# EAGLE design E200 (EAGLE 9.5.1)
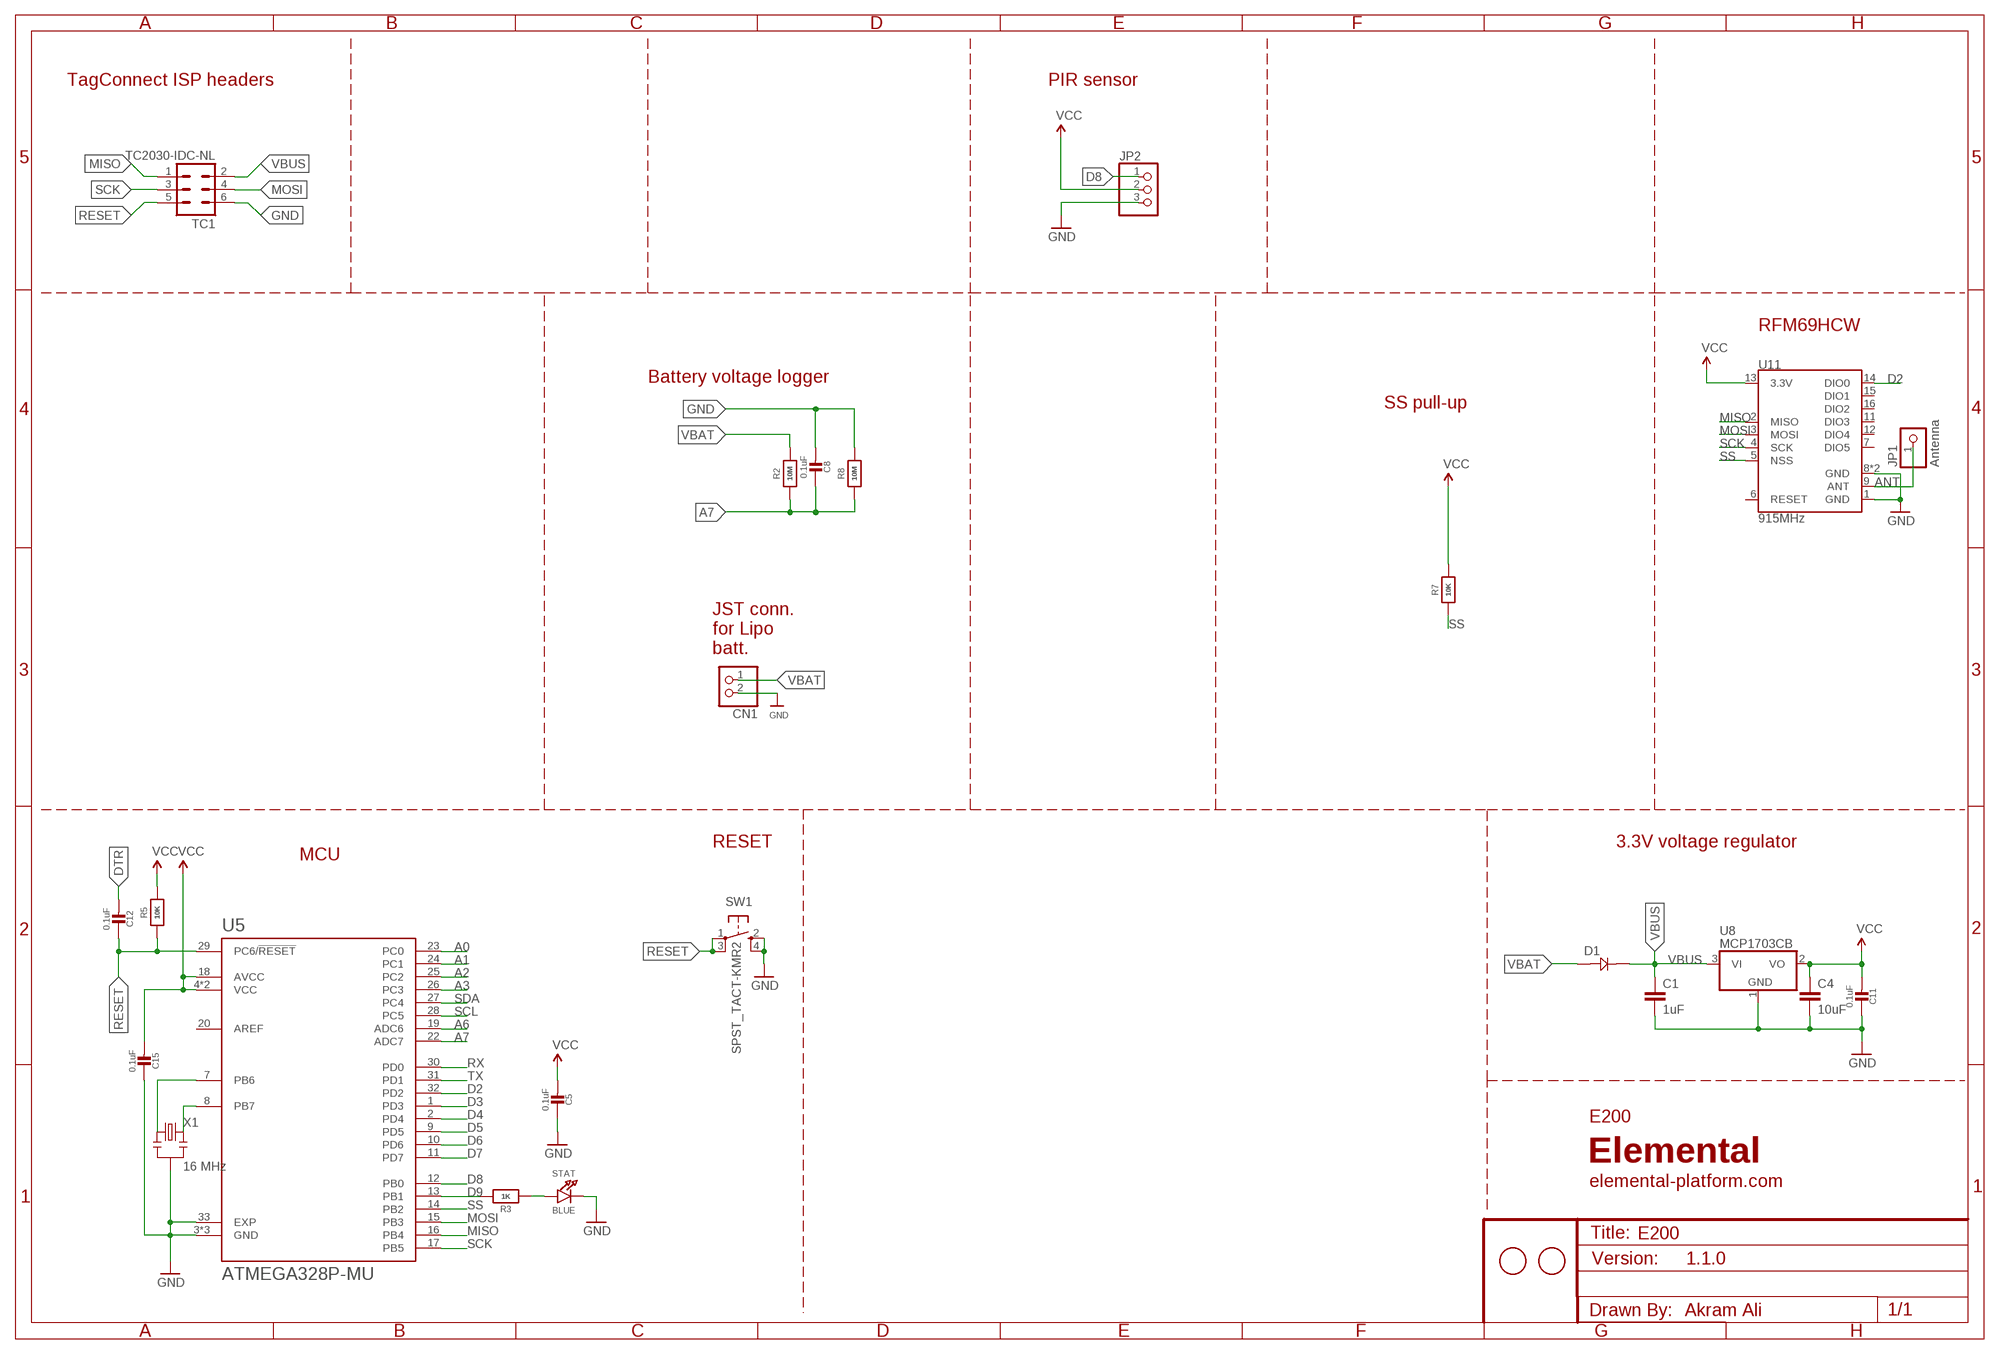
[diagram p0: schematic, sheet 1]

## Parts
C1  1uF  CAP0805  [0805]
C4  10uF  CAP0805  [0805]
C5  0.1uF  MICROBUILDER_CAP_CERAMIC_0402MP  [MICROBUILDER__0402MP]
C8  0.1uF  MICROBUILDER_CAP_CERAMIC_0402MP  [MICROBUILDER__0402MP]
C11  0.1uF  MICROBUILDER_CAP_CERAMIC_0402MP  [MICROBUILDER__0402MP]
C12  0.1uF  MICROBUILDER_CAP_CERAMIC_0402MP  [MICROBUILDER__0402MP]
C15  0.1uF  MICROBUILDER_CAP_CERAMIC_0402MP  [MICROBUILDER__0402MP]
CN1  JST_2PIN-SMT-RA  [JST-PH-2-SMT-RA]
D1  DIODE_SCHOTTKY0805-RES  [0805]
JP1  Antenna  PINHD-1X1CB  [1X01-CLEANBIG]
JP2  PINHD-1X3  [1X03]
R2  10M  MICROBUILDER_RESISTOR_0402MP  [MICROBUILDER__0402MP]
R3  1K  MICROBUILDER_RESISTOR_0402MP  [MICROBUILDER__0402MP]
R5  10K  MICROBUILDER_RESISTOR_0402MP  [MICROBUILDER__0402MP]
R7  10K  MICROBUILDER_RESISTOR_0402MP  [MICROBUILDER__0402MP]
R8  10M  MICROBUILDER_RESISTOR_0402MP  [MICROBUILDER__0402MP]
STAT  BLUE  LED0805_NOOUTLINE  [CHIPLED_0805_NOOUTLINE]
SW1  SPST_TACT-KMR2  [KMR2]
TC1  TC2030-IDC-NL  [TC2030-IDC-NL]
U5  ATMEGA328P-MU  [QFN50P500X500X100-33N]
U8  MCP1703CB  [SOT23]
U11  915MHz  RFM69HCW-915  [RFM69HCW-XXXS2]
U$1  FIDUCIAL  [FIDUCIAL_1MM]
U$7  FIDUCIAL  [FIDUCIAL_1MM]
X1  16 MHz  RESONATORSMD  [RESONATOR-SMD]

## Nets
A0: U5.23(PC0)
A1: U5.24(PC1)
A2: U5.25(PC2)
A3: U5.26(PC3)
A6: U5.19(ADC6)
A7: C8.1 R2.1 R8.1 U5.22(ADC7)
ANT: JP1.1 U11.9(ANT)
D2: U5.32(PD2) U11.14(DIO0)
D3: U5.1(PD3)
D4: U5.2(PD4)
D5: U5.9(PD5)
D6: U5.10(PD6)
D7: U5.11(PD7)
D8: JP2.1 U5.12(PB0)
D9: R3.2 U5.13(PB1)
DTR: C12.2
GND: C1.2 C4.2 C5.1 C8.2 C11.1 C15.1 CN1.2 JP2.3 R8.2 STAT.C SW1.2(S) SW1.4(S1) TC1.6 U5.3(GND) U5.5(GND) U5.21(GND) U5.33(EXP) U8.1(GND) U11.1(GND) U11.8(GND) U11.10(GND) X1.2
MISO: TC1.1 U5.16(PB4) U11.2(MISO)
MOSI: TC1.4 U5.15(PB3) U11.3(MOSI)
N$4: U5.8(PB7) X1.3
N$5: U5.7(PB6) X1.1
N$8: R3.1 STAT.A
RESET: C12.1 R5.1 SW1.1(P) SW1.3(P1) TC1.5 U5.29(PC6/!RESET)
RX: U5.30(PD0)
SCK: TC1.3 U5.17(PB5) U11.4(SCK)
SCL: U5.28(PC5)
SDA: U5.27(PC4)
SS: R7.1 U5.14(PB2) U11.5(NSS)
TX: U5.31(PD1)
VBAT: CN1.1 D1.1 R2.2
VBUS: C1.1 D1.2 TC1.2 U8.3(VI)
VCC: C4.1 C5.2 C11.2 C15.2 JP2.2 R5.2 R7.2 U5.4(VCC) U5.6(VCC) U5.18(AVCC) U8.2(VO) U11.13(3.3V)
Unconnected: U5.20(AREF) U11.6(RESET) U11.7(DIO5) U11.11(DIO3) U11.12(DIO4) U11.15(DIO1) U11.16(DIO2)

## Notes on the sheet
- TagConnect ISP headers | PIR sensor
- RFM69HCW
- Battery voltage logger
- SS pull-up
- JST conn.
  for Lipo
  batt.
- RESET | 3.3V voltage regulator
- MCU
- E200
- Elemental
- elemental-platform.com
- 1.1.0
- Akram Ali

## Library data of the parts
C1 = SparkFun-Capacitors:CAP: Capacitor Standard 0603 ceramic capacitor, and 0.1" leaded capacitor.; MPN: CC0805ZRY5V8BB105
C4 = SparkFun-Capacitors:CAP: Capacitor Standard 0603 ceramic capacitor, and 0.1" leaded capacitor.; MPN: CC0805KKX5R6BB106
C5 C8 C11 C12 C15 = Adafruit Feather 32u4 Bluefruit LE:MICROBUILDER_CAP_CERAMIC: Ceramic Capacitors For new designs, use the packages preceded by an '_' character since they are more reliable: The following footprints should be used on most boards: _0402 - Standard footprint for regular board layouts _0603 - Standard footprint for regular board layouts _0805 - Standard footprint for regular board layouts _1206 - Standard footprint for regular board layouts For extremely tight-pitch boards where space is at a premium, the following 'micro-pitch' footprints can be used (smaller pads, no silkscreen outline, etc.): _0402MP - Micro-pitch footprint for very dense/compact boards _0603MP - Micro-pitch footprint for very dense/compact boards _0805MP - Micro-pitch footprint for very dense/compact boards _1206MP - Micro-pitch footprint for very dense/compact boards; MPN: GRM155R71C104KA88J
CN1 = adafruit:JST_2PIN: JST 2-Pin Connectors of various flavors SMT-RA (S2B-PH-SM4) 4UConnector #17311 SMT (B2B-PH-SM4) THM-RA (S2B-PH) THM (B2B-PH)
D1 = SCHOTTKY_0805:DIODE_SCHOTTKY
JP1 = adafruit@1:PINHD-1X1: Pin header 1x1 for 0.1" spacing With round pins; MPN: Helical antenna
JP2 = adafruit:PINHD-1X3: PIN HEADER
R2 R3 R5 R7 R8 = Adafruit Feather 32u4 Bluefruit LE:MICROBUILDER_RESISTOR: Resistors For new designs, use the packages preceded by an '_' character since they are more reliable: The following footprints should be used on most boards: _0402 - Standard footprint for regular board layouts _0603 - Standard footprint for regular board layouts _0805 - Standard footprint for regular board layouts _1206 - Standard footprint for regular board layouts For extremely tight-pitch boards where space is at a premium, the following 'micro-pitch' footprints can be used (smaller pads, no silkscreen outline, etc.): _0402MP - Micro-pitch footprint for very dense/compact boards _0603MP - Micro-pitch footprint for very dense/compact boards _0805MP - Micro-pitch footprint for very dense/compact boards _1206MP - Micro-pitch footprint for very dense/compact boards; MPN: RC0402JR-0710KL
STAT = microbuilder:LED: LED 0603 - 0603 Surface Mount Package 2mA: Green LED - Low Power (3.9mcd, 2ma, 1.7Vf) - Digikey: 475-2709-2-ND Orange LED - Low Power (9.8mcd, 2ma, 1.8Vf) - Digikey: 475-1194-2-ND Red LED - Low Power (5mcd, 2ma, 1.8Vf) - Digikey: 475-1195-2-ND Yellow LED - Low Power (7mcd, 2ma, 1.8Vf) - Digikey: 475-1196-2-ND 5mA: Blue LED - Low Power (17mcd, 5ma, 2.9Vf) - Digikey: LNJ937W8CRACT-ND 0805 - 0805 Surface Mount Package 2mA: Red LED (8.8mcd, 2mA, 1.8Vf, Clear) - Low Power [Digikey: 475-2510-1-ND] Green LED (5mcd, 2mA, 1.8Vf, Clear) - Low Power [Digikey: 475-2730-1-ND] Yellow LED (11.3mcd, 2mA, 1.8Vf, Clear) - Low Power [Digikey: 475-2555-1-ND] 20mA: Red LED (104mcd, 20mA, Diffused) - LS R976 [Digikey: 475-1278-6-ND] Red LED (12mcd, 20mA, 2.0Vf, Clear) - APT2012EC [Digikey: 754-1128-1-ND] Green LED (15mcd, 20mA, 2.2Vf, Clear) - APT2012GC [Digikey: 754-1131-1-ND] Orange LED (160mcd, 20mA, 2.1Vf, Clear) - APT2012SECK [Digikey: 754-1130-1-ND] 1206 - 1206 Surface Mount Package Green LED (26mcd, 20mA, Diffused) - LG N971 [Digikey: 475-1407-6-ND] Red LED (15mcd, 20mA, Diffused) - LH N974 [Digikey: 475-1416-6-ND] Cree - Cree High-Power Surface Mount LEDs XPEBWT-L1-0000-00D50 - White 111lm 350mA 2.9Vf 6200K 110° XTEAWT-00-0000-00000LEE3 - White 114lm 350mA 2.85Vf 5000K 115° Everlight - Everlight 45-21 Series Surface Mount LEDs 45-21/QK2C-B2832AC2CB2/2T - Warm White 2000mcd 20mA 3.25Vf 3050K 120° 45-21/LK2C-B38452C4CB2/2T - Nuetral White 2000mcd 20mA 3.25Vf 4150K 120° 45-21/LK2C-B50634C6CB2/2T - Cold White 2200mcd 20mA 3.25Vf 5650K 120° PLCC2 Reverse Mount LS T77K-J1L2-1-0-2-R18-Z - Red 11.25mcd 2mA 1.8Vf 630nm 120° LO T77K-L1M2-24-Z - Orange 19.6mcd 2mA 1.8Vf 606nm 120° LY T77K-K2M1-26-Z - Yellow 15.7mcd 2mA 1.8Vf 587nm 120°
SW1 = adafruit:SPST_TACT: SMT 6mm switch, EVQQ2 series http://www.ladyada.net/library/eagle
TC1 = TagConnect:TC2030-IDC: Tag-Connect In Circuit Programming & Debug Cable 6 Pin http://www.tag-connect.com
U5 = ATMEGA328P-MU:ATMEGA328P-MU: ATmega Series 20 MHz 32 KB Flash 2 KB SRAM 8-Bit Microcontroller - QFN-32; AVAILABILITY: Good; DESCRIPTION: ATmega Series 20 MHz 32 KB Flash 2 KB SRAM 8-Bit Microcontroller - QFN-32; MF: Atmel; MP: ATMEGA328P-MU; MPN: ATMEGA328P-MU; PACKAGE: QFN-32 Atmel; PRICE: 2.55 USD
U8 = linear:MCP1703: 250 mA, 16V, Low Quiescent Current LDO Regulator Source: http://ww1.microchip.com/downloads/en/DeviceDoc/22049b.pdf; MPN: MCP1703T-3302E/CB; OC_NEWARK: 18T9177
U11 = SparkFun-RF:RFM69H: Hope RF RFM69H ISM Transceiver Module The RFM69H is a transceiver module capable of operation over a wide frequency range, including the 315,433,868 and 915MHz license-free ISM (Industry Scientific and Medical) frequency bands. All major RF communication parameters are programmable and most of them can be dynamically set. The RFM69H offers the unique advantage of programmable narrow-band and wide- band communication modes. The RFM69H is optimized for low power consumption while offering high RF output power and channelized operation.Compliance ETSI and FCC regulations. Datasheet <http://www.hoperf.cn/upload/docs/RF/SX/RFM69H_DataSheet_v1.3.pdf> SparkFun Products RFM69HCW Wireless Transceiver - 915MHz <https://www.sparkfun.com/products/13909> (COM-13909) RFM69HCW Wireless Transceiver - 434MHz <https://www.sparkfun.com/products/13910> (COM-13910) SparkFun RFM69 Breakout (915MHz) <https://www.sparkfun.com/products/12775> (WRL-12775) SparkFun RFM69 Breakout (434MHz) <https://www.sparkfun.com/products/12823> (WRL-12823); MPN: RFM69HCW; PROD_ID: IC-11997
U$1 U$7 = adafruit:FIDUCIAL: For use by pick and place machines to calibrate the vision/machine, 1mm By microbuilder.eu
X1 = SparkFun:RESONATOR: Resonator Small SMD resonator. This is the itty bitty 10/20MHz resonators with built in caps. CSTCE10M0G55 and CSTCE20M0V53. Footprint has been reviewed closely but hasn't been tested yet.; MPN: CSTCE16M0V53-R0

## Net classes
1 power: width 0.381 mm, clearance 0.254 mm

## Board
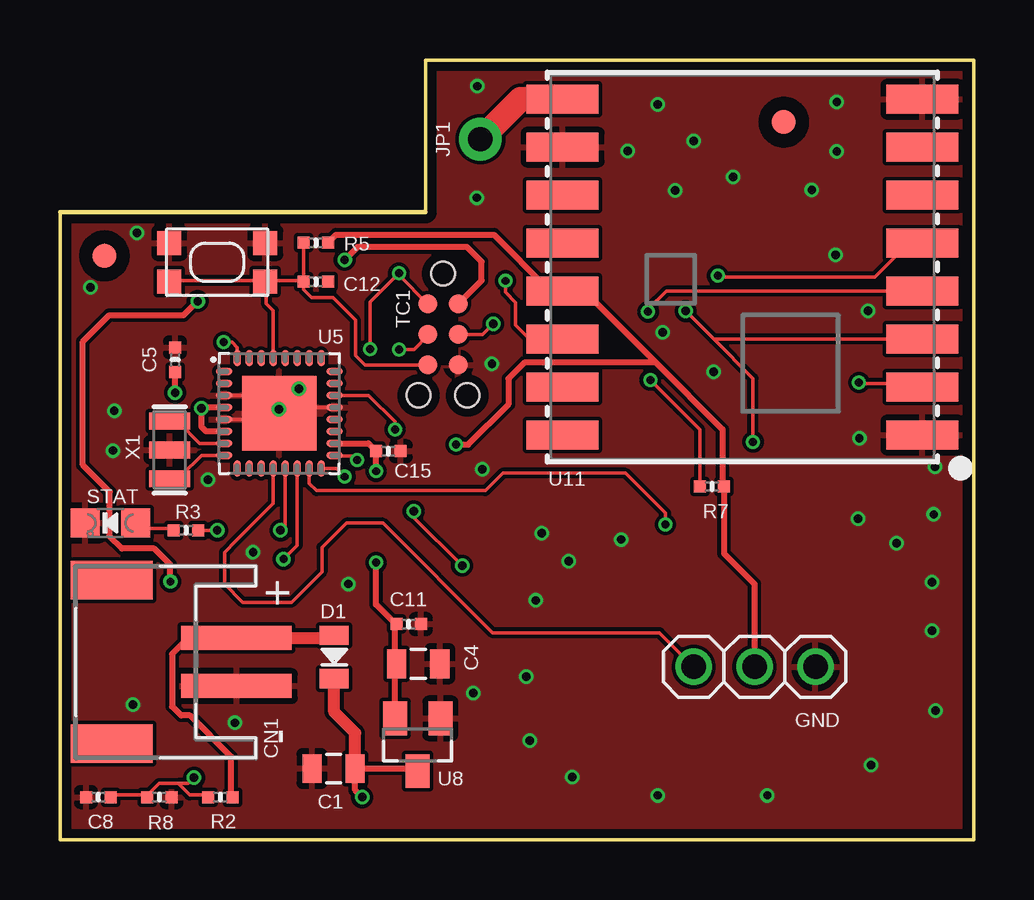
[diagram p1: board, top side]
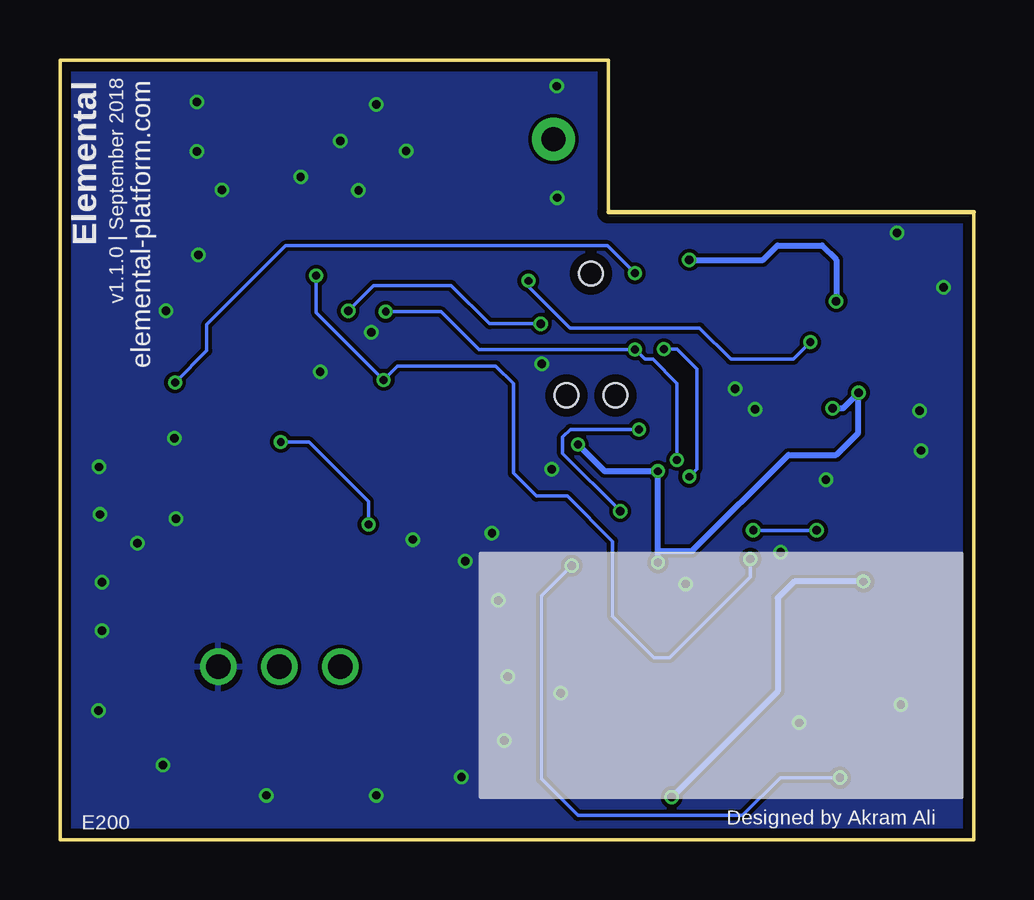
[diagram p2: board, bottom side, seen from below]

Size 38.1 x 32.51 mm. Coordinates in mm from the lower left corner, seen from the top.
Outline: 0,26.16 15.24,26.16 15.24,32.51 38.1,32.51 38.1,0 0,0 0,26.16
Copper layers (1*16): Top 0.035559375mm / dielectric 1.6mm / Bottom 0.035559375mm
Design rules "oshpark-2layer *": minimum track width 6mil, minimum drill 10mil, track to track 6mil, track to pad 6mil, pad to pad 6mil, via to via 6mil, smd to smd 6mil, copper to edge 15mil, drill to drill 6mil, minimum pad ring 5mil, minimum via ring 5mil, stop-mask expansion 2.5mil, vias tented up to drill 14mil, thermal gap 10mil

### Footprints (pad centres in the part's own frame; a part is rotated, then mirrored left to right if it is on the bottom)
0805 = smd 0.8 x 1.2: 1 -0.9,0; 2 0.9,0
MICROBUILDER__0402MP = smd 0.5 x 0.5: 1 -0.508,0; 2 0.508,0
JST-PH-2-SMT-RA = smd 1 x 4.6: 1 1,-3.7; 2 -1,-3.7 | smd 1.6 x 3.4: NC1 -3.4,1.5; NC2 3.4,1.5
1X01-CLEANBIG = drill 1.016 pad 1.778: 1 0,0
1X03 = drill 1.016: 1 -2.54,0; 2 0,0; 3 2.54,0
CHIPLED_0805_NOOUTLINE = smd 1.2 x 1.2: A 0,-1.05; C 0,1.05
KMR2 = smd 1 x 1: 1 2,0.8; 2 2,-0.8; 3 -2,0.8; 4 -2,-0.8
TC2030-IDC-NL = smd 0.787 x 0.787: 1 -1.27,-0.635; 2 -1.27,0.635; 3 0,-0.635; 4 0,0.635; 5 1.27,-0.635; 6 1.27,0.635 | hole 0.991: -2.54,0; 2.54,1.016; 2.54,-1.016
QFN50P500X500X100-33N = smd 0.7 x 0.3: 1 -2.3,1.75; 2 -2.3,1.25; 3 -2.3,0.75; 4 -2.3,0.25; 5 -2.3,-0.25; 6 -2.3,-0.75; 7 -2.3,-1.25; 8 -2.3,-1.75; 17 2.3,-1.75; 18 2.3,-1.25; 19 2.3,-0.75; 20 2.3,-0.25; 21 2.3,0.25; 22 2.3,0.75; 23 2.3,1.25; 24 2.3,1.75 | smd 0.3 x 0.7: 9 -1.75,-2.3; 10 -1.25,-2.3; 11 -0.75,-2.3; 12 -0.25,-2.3; 13 0.25,-2.3; 14 0.75,-2.3; 15 1.25,-2.3; 16 1.75,-2.3; 25 1.75,2.3; 26 1.25,2.3; 27 0.75,2.3; 28 0.25,2.3; 29 -0.25,2.3; 30 -0.75,2.3; 31 -1.25,2.3; 32 -1.75,2.3 | smd 3.1 x 3.1: 33 0,0
SOT23 = smd 1 x 1.4: 1 -0.95,-1.1; 2 0.95,-1.1; 3 0,1.1
RFM69HCW-XXXS2 = smd 3 x 1.2: 1 -7.5,7; 2 -7.5,5; 3 -7.5,3; 4 -7.5,1; 5 -7.5,-1; 6 -7.5,-3; 7 -7.5,-5; 8 -7.5,-7; 9 7.5,-7; 10 7.5,-5; 11 7.5,-3; 12 7.5,-1; 13 7.5,1; 14 7.5,3; 15 7.5,5; 16 7.5,7
FIDUCIAL_1MM = smd 1 x 1: 1 0,0
RESONATOR-SMD = smd 0.7 x 1.7: 1 -1.2,0; 2 0,0; 3 1.2,0

### Placement (x,y rotation side)
C1  11.4,2.97 180 top
C4  14.94,7.34 0 top
C5  4.8,20.02 270 top
C8  1.6,1.78 180 top
C11  14.54,8.99 180 top
C12  10.67,23.27 0 top
C15  13.69,16.21 180 top
CN1  3.66,7.42 90 top
D1  11.43,7.62 270 top
JP1  17.53,29.21 0 top
JP2  28.96,7.21 0 top
R2  6.68,1.78 0 top
R3  5.26,12.9 0 top
R5  10.67,24.89 0 top
R7  27.18,14.73 0 top
R8  4.14,1.78 0 top
STAT  2.11,13.21 90 top
SW1  6.55,24.08 180 top
TC1  15.96,21.07 270 top
U5  9.14,17.78 0 top
U8  14.91,3.96 180 top
U11  28.45,23.88 180 top
U$1  30.18,29.92 0 top
U$7  1.85,24.35 0 top
X1  4.57,16.26 270 top

### Tracks (layer width: path | path; a pad name or v marks a point on that pad's centre or on a via)
A7  (via drill 0.33, 0.35)
  Top 0.152: C8.1 2.22,1.87 3.49,1.87 R8.1 3.65,1.87 4.13,2.35 4.92,2.35 | 4.92,2.35 5.4,1.87 6.08,1.87 R2.1 | v13.97,17.11 13.97,17.43 12.87,18.53 U5.22 | v5.59,2.59 5.35,2.35 4.92,2.35 | v16.76,11.43 14.74,13.45 v14.74,13.7
  Bottom 0.152: v13.97,17.11 16.83,17.11 17.14,16.8 17.14,16.1 v14.74,13.7 | v5.59,2.59 8.08,2.59 9.65,1.02 16.51,1.02 18.03,2.54 18.03,10.16 v16.76,11.43
ANT
  Top 1.016: U11.9 19.19,30.88 JP1.1
D2  (via drill 0.33)
  Top 0.152: v18.57,23.3 18.57,22.83 19,22.4 19,21.46 19.54,20.92 20.8,20.92 U11.14 | U5.32 7.39,20.52 7.17,20.75 v6.82,20.75
  Bottom 0.152: v18.57,23.3 18.57,23.07 16.84,21.34 11.44,21.34 10.14,20.04 7.53,20.04 v6.82,20.75
D8
  Top 0.152: U5.12 8.89,14.02 7.34,12.47 6.86,11.99 6.86,10.67 7.62,9.91 9.65,9.91 10.92,11.18 10.92,12.19 11.94,13.21 13.46,13.21 18.03,8.64 24.99,8.64 JP2.1
D9  (via drill 0.35)
  Top 0.152: v9.2,12.9 9.39,13.1 U5.13 | R3.2 v6.55,12.9
  Bottom 0.152: v6.55,12.9 v9.2,12.9
GND  (via drill 0.35)
  Top 0.152: U5.21 10.72,18.03 v9.96,18.8 | U5.5 8.69,17.53 v9.12,17.96 8.55,18.53 U5.3
  other vias: 7.29,4.88 2.21,16.23 18.01,19.84 24.92,30.66 26.42,29.13 31.34,27.1 28.07,27.64 17.4,31.42 17.37,26.77 3.05,5.64 20.09,12.78 36.5,5.38 34.87,12.37 33.32,16.74 33.27,13.39 6.17,15.01 8.05,11.99 3.2,25.3 2.26,17.88 1.27,23.04 17.6,15.44 27.25,19.51 33.68,22.05 32.33,24.38 25.65,27.08 32.38,30.76 23.67,28.73 32.38,28.7 25.12,21.16 17.22,6.12 21.21,11.61 36.47,15.54 36.43,13.57 12.01,10.67 19.43,6.81 36.35,8.71 19.58,4.14 36.35,10.74 19.84,9.98 23.39,12.52 21.36,2.62 24.92,1.85 29.49,1.85 33.81,3.12
  pour Top (rank 6): 39.37,33.78 39.37,-1.27 -1.27,-1.27 -1.27,33.78
  pour Bottom: -1.52,34.04 39.62,34.04 39.62,-1.52 -1.52,-1.52
MISO  (via drill 0.33)
  Top 0.152: U11.2 35.88,19.02 33.35,19.02 v33.31,19.06 | U5.16 11.53,15.48 v11.87,15.14 | v12.92,20.45 12.92,22.41 v14.13,23.62 14.13,23.54 TC1.1
  Bottom 0.152: v33.31,19.06 31.98,20.39 31.98,21.49 28.7,24.77 15.27,24.77 v14.13,23.62 | v11.87,15.14 11.56,15.45 11.56,19.63 12.38,20.45 v12.92,20.45
MOSI  (via drill 0.33, 0.35)
  Top 0.152: v25.24,13.14 25.24,13.62 23.57,15.29 18.47,15.29 17.73,14.55 10.69,14.55 10.39,14.85 U5.15 | v18.06,21.51 17.61,21.07 TC1.4 | v26.09,22.05 27.26,20.88 | U11.3 27.26,20.88 | v28.89,16.59 28.89,19.24 27.26,20.88
  Bottom 0.152: v18.06,21.51 20.19,21.51 21.79,23.11 25.02,23.11 v26.09,22.05 | v28.89,16.59 27.72,16.59 25.24,14.12 v25.24,13.14
N$4
  Top 0.152: X1.3 4.6,15.21 5.08,15.21 5.9,16.03 U5.8
N$5
  Top 0.152: X1.1 4.6,17.43 4.92,17.43 5.82,16.53 U5.7
N$8
  Top 0.152: R3.1 4.6,12.99 3.33,12.99 3.17,13.14 STAT.A
RESET
  Top 0.152: 8.89,23.3 8.57,23.3 SW1.3 | 8.89,23.3 10.16,23.3 | 10.16,23.3 R5.1 | 10.16,23.3 C12.1 10.16,22.94 10.49,22.61 11.38,22.61 12.32,21.67 12.32,20.19 12.71,19.8 TC1.5 | 8.89,23.3 SW1.3 | SW1.1 4.6,23.3 8.41,23.3 SW1.3 | U5.29 8.89,22.07 8.6,22.36 8.6,23.23 SW1.3
SCK  (via drill 0.33)
  Top 0.152: v12.38,15.84 12.22,16 11.59,16 U5.17 | v14.13,20.45 14.76,20.45 15.33,21.01 TC1.3 | U11.4 25.28,22.88 24.52,22.12 v24.52,22.02
  Bottom 0.152: v24.52,22.02 22.21,22.02 20.64,20.45 v14.13,20.45 13.72,20.03 13.39,20.03 12.38,19.03 v12.38,15.84
SS  (via drill 0.33, 0.35)
  Top 0.152: v24.61,19.18 26.67,17.11 R7.1 | U11.5 35.88,24.73 35.24,24.73 33.97,23.46 27.47,23.46 v27.42,23.51 | U5.14 9.89,12.98 9.89,12.27 v9.32,11.71
  Bottom 0.152: v27.42,23.51 27.42,21.99 v24.61,19.18 24.02,19.76 19.94,19.76 19.2,19.02 19.2,15.29 18.24,14.33 16.94,14.33 15.06,12.45 15.06,9.31 13.34,7.59 12.7,7.59 9.32,10.97 v9.32,11.71
VBAT
  Top 0.254: R2.2 7.14,1.87 7.14,3.46 5.42,5.18 5.05,5.18 4.67,5.56 4.67,7.75 5.34,8.42 CN1.1
  Top 0.508: CN1.1 11.33,8.42 D1.1
VBUS  (via drill 0.33, 0.35)
  Top 0.254: v11.87,24.18 12.4,24.71 16.97,24.71 17.58,24.11 17.58,23.32 TC1.2 | v5.74,22.45 5.16,21.87 2.06,21.87 0.95,20.77 0.95,15.63 2.08,14.5 2.08,12.65 2.59,12.14 3.94,12.14 4.6,11.47 v4.6,10.76 | U8.3 14.8,2.97 C1.1 12.3,2.07 v12.6,1.78
  Top 0.508: D1.2 11.43,5.33 12.3,4.46 C1.1
  Bottom 0.254: v4.6,10.76 7.49,10.76 8.18,10.08 8.18,6.2 v12.6,1.78 | v11.87,24.18 8.79,24.18 8.19,24.78 6.34,24.78 5.74,24.18 v5.74,22.45
VCC  (via drill 0.33, 0.35)
  Top 0.152: 13.97,7.43 C4.1 13.96,7.27 | 13.97,9.02 C11.2 | 20.32,22.99 20.8,22.99 U11.13 20.95,22.83 | v13.18,15.37 | 5.89,17.22 5.9,17.22
  Top 0.254: 13.97,7.43 13.97,8.86 C11.2 | v13.18,11.56 13.18,9.81 13.97,9.02 | 20.32,22.99 18.09,25.22 11.51,25.22 R5.2 | 24.85,19.89 21.91,22.83 20.95,22.83 | 24.85,19.89 27.62,17.11 27.62,14.79 R7.2 27.69,11.94 28.96,10.67 JP2.2 | v13.18,15.37 C15.2 12.86,16.53 U5.18 | v4.8,18.64 C5.2 | U5.6 6.08,17.03 5.89,17.22 | 5.9,17.22 v5.9,17.99 5.94,18.03 U5.4 | U8.2 13.96,7.27 | v16.51,16.48 17.02,16.48 18.69,18.16 18.69,19.23 19.36,19.89 24.85,19.89
  Bottom 0.152: 4.83,18.62 v4.8,18.64
  Bottom 0.254: v13.18,11.56 13.18,12.03 | 13.18,12.03 v13.18,15.37 15.4,15.37 v16.51,16.48 | 13.18,12.03 11.75,12.03 7.73,16.05 5.74,16.05 4.83,16.97 4.83,18.62 | v4.8,18.64 5.46,17.99 v5.9,17.99

### Text on the board
_tsilk: GND
_bsilk: elemental-platform.com | v1.1.0 | September 2018 | Elemental | Designed by Akram Ali | E200